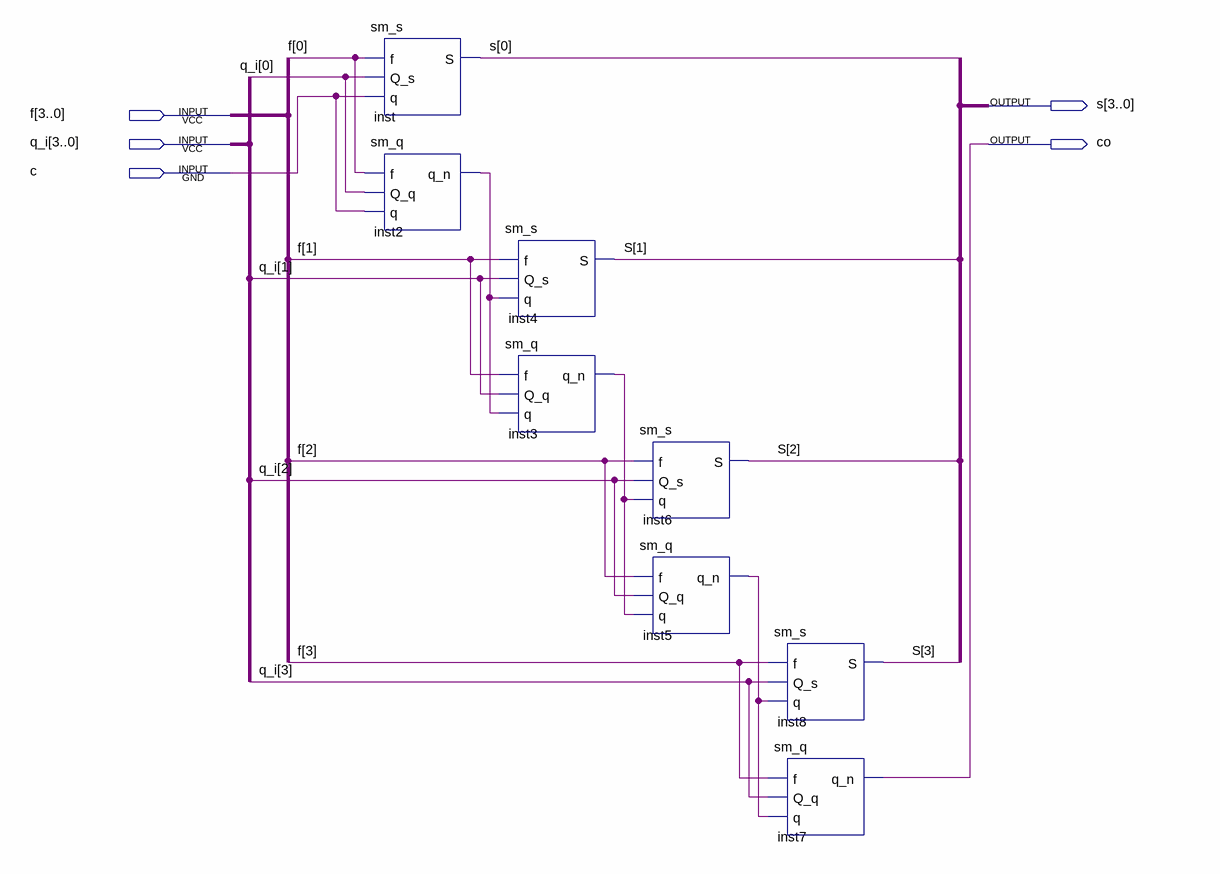
[diagram p0: schematic sheet]
// Quartus schematic sm.bdf as structural Verilog: 8 symbols, 5 pins
module sm (
  input  [3:0] f,
  input  [3:0] q_i,
  input  c,
  output [3:0] s,
  output co
);

  wire inst2_q_n, inst3_q_n, inst5_q_n;

  sm_s inst (.f(f[0]), .q(c), .Q_s(q_i[0]), .S(s[0]));
  sm_q inst2 (.f(f[0]), .q(c), .Q_q(q_i[0]), .q_n(inst2_q_n));
  sm_s inst4 (.f(f[1]), .q(inst2_q_n), .Q_s(q_i[1]), .S(s[1]));
  sm_q inst3 (.f(f[1]), .q(inst2_q_n), .Q_q(q_i[1]), .q_n(inst3_q_n));
  sm_s inst6 (.f(f[2]), .q(inst3_q_n), .Q_s(q_i[2]), .S(s[2]));
  sm_q inst5 (.f(f[2]), .q(inst3_q_n), .Q_q(q_i[2]), .q_n(inst5_q_n));
  sm_s inst8 (.f(f[3]), .q(inst5_q_n), .Q_s(q_i[3]), .S(s[3]));
  sm_q inst7 (.f(f[3]), .q(inst5_q_n), .Q_q(q_i[3]), .q_n(co));
endmodule
